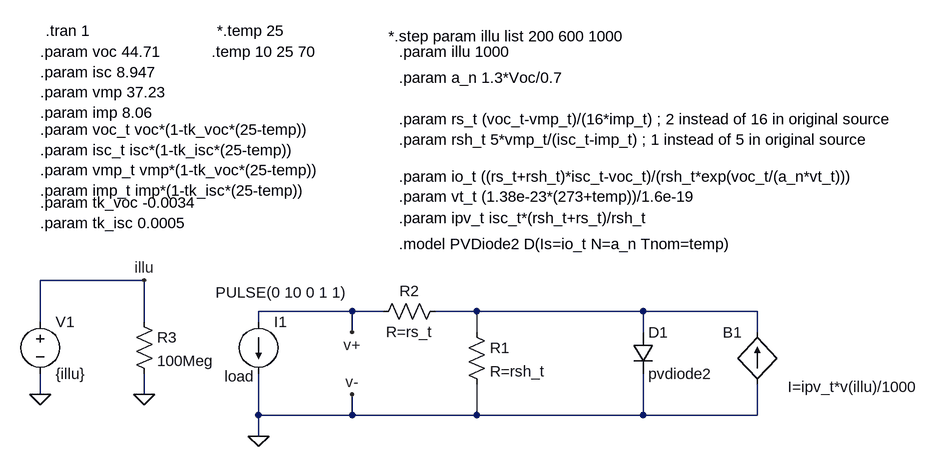
[diagram p0: schematic sch2_complete.asc]
sch2_complete.asc, the LTspice schematic file:
Version 4
SHEET 1 1264 680
WIRE -368 -16 -528 -16
WIRE -48 32 -192 32
WIRE 0 32 -48 32
WIRE 144 32 80 32
WIRE 400 32 144 32
WIRE 576 32 400 32
WIRE -528 48 -528 -16
WIRE -368 48 -368 -16
WIRE -192 48 -192 32
WIRE -48 64 -48 32
WIRE 144 64 144 32
WIRE 400 64 400 32
WIRE 576 64 576 32
WIRE -528 160 -528 128
WIRE -368 160 -368 128
WIRE -192 192 -192 128
WIRE -48 192 -48 160
WIRE -48 192 -192 192
WIRE 144 192 144 144
WIRE 144 192 -48 192
WIRE 400 192 400 128
WIRE 400 192 144 192
WIRE 576 192 576 144
WIRE 576 192 400 192
WIRE -192 224 -192 192
FLAG -528 160 0
FLAG -368 160 0
FLAG -192 224 0
FLAG -48 64 v+
FLAG -48 160 v-
FLAG -368 -16 illu
SYMBOL res 128 48 R0
SYMATTR InstName R1
SYMATTR Value R=rsh_t
SYMBOL res 96 16 R90
WINDOW 0 0 56 VBottom 2
WINDOW 3 32 56 VTop 2
SYMATTR InstName R2
SYMATTR Value R=rs_t
SYMBOL current -192 48 R0
WINDOW 3 -66 -45 Left 2
WINDOW 123 0 0 Left 0
WINDOW 39 -52 84 Left 2
SYMATTR Value PULSE(0 10 0 1 1)
SYMATTR SpiceLine load
SYMATTR InstName I1
SYMBOL bi 576 144 R180
WINDOW 0 24 80 Left 2
WINDOW 3 -246 -4 Left 2
SYMATTR InstName B1
SYMATTR Value I=ipv_t*v(illu)/1000
SYMBOL diode 384 64 R0
SYMATTR InstName D1
SYMATTR Value pvdiode2
SYMBOL res -384 32 R0
SYMATTR InstName R3
SYMATTR Value 100Meg
SYMBOL voltage -528 32 R0
SYMATTR InstName V1
SYMATTR Value {illu}
TEXT 24 -72 Left 2 !.model PVDiode2 D(Is=io_t N=a_n Tnom=temp)
TEXT -520 -400 Left 2 !.tran 1
TEXT -528 -368 Left 2 !.param voc 44.71\n.param isc 8.947\n.param vmp 37.23\n.param imp 8.06
TEXT -528 -136 Left 2 !.param tk_voc -0.0034
TEXT -528 -104 Left 2 !.param tk_isc 0.0005
TEXT -256 -400 Left 2 !*.temp 25
TEXT -264 -368 Left 2 !.temp 10 25 70
TEXT 8 -392 Left 2 !*.step param illu list 200 600 1000
TEXT 24 -368 Left 2 !.param illu 1000
TEXT -528 -248 Left 2 !.param voc_t voc*(1-tk_voc*(25-temp))\n.param isc_t isc*(1-tk_isc*(25-temp))\n.param vmp_t vmp*(1-tk_voc*(25-temp))\n.param imp_t imp*(1-tk_isc*(25-temp))
TEXT 24 -328 Left 2 !.param a_n 1.3*Voc/0.7
TEXT 24 -264 Left 2 !.param rs_t (voc_t-vmp_t)/(16*imp_t) ; 2 instead of 16 in original source\n.param rsh_t 5*vmp_t/(isc_t-imp_t) ; 1 instead of 5 in original source
TEXT 24 -176 Left 2 !.param io_t ((rs_t+rsh_t)*isc_t-voc_t)/(rsh_t*exp(voc_t/(a_n*vt_t)))\n.param vt_t (1.38e-23*(273+temp))/1.6e-19
TEXT 24 -112 Left 2 !.param ipv_t isc_t*(rsh_t+rs_t)/rsh_t

The netlist it stands for:
* sch2_complete.asc
R1 N001 0 R=rsh_t
R2 N001 v+ R=rs_t
I1 v+ 0 PULSE(0 10 0 1 1) load
B1 0 N001 I=ipv_t*v(illu)/1000
D1 N001 0 pvdiode2
R3 illu 0 100Meg
V1 illu 0 {illu}
.model D D
.lib standard.dio
.model PVDiode2 D(Is=io_t N=a_n Tnom=temp)
.tran 1
.param voc 44.71
.param isc 8.947
.param vmp 37.23
.param imp 8.06
.param tk_voc -0.0034
.param tk_isc 0.0005
*.temp 25
.temp 10 25 70
*.step param illu list 200 600 1000
.param illu 1000
.param voc_t voc*(1-tk_voc*(25-temp))
.param isc_t isc*(1-tk_isc*(25-temp))
.param vmp_t vmp*(1-tk_voc*(25-temp))
.param imp_t imp*(1-tk_isc*(25-temp))
.param a_n 1.3*Voc/0.7
.param rs_t (voc_t-vmp_t)/(16*imp_t) ; 2 instead of 16 in original source
.param rsh_t 5*vmp_t/(isc_t-imp_t) ; 1 instead of 5 in original source
.param io_t ((rs_t+rsh_t)*isc_t-voc_t)/(rsh_t*exp(voc_t/(a_n*vt_t)))
.param vt_t (1.38e-23*(273+temp))/1.6e-19
.param ipv_t isc_t*(rsh_t+rs_t)/rsh_t
.backanno
.end